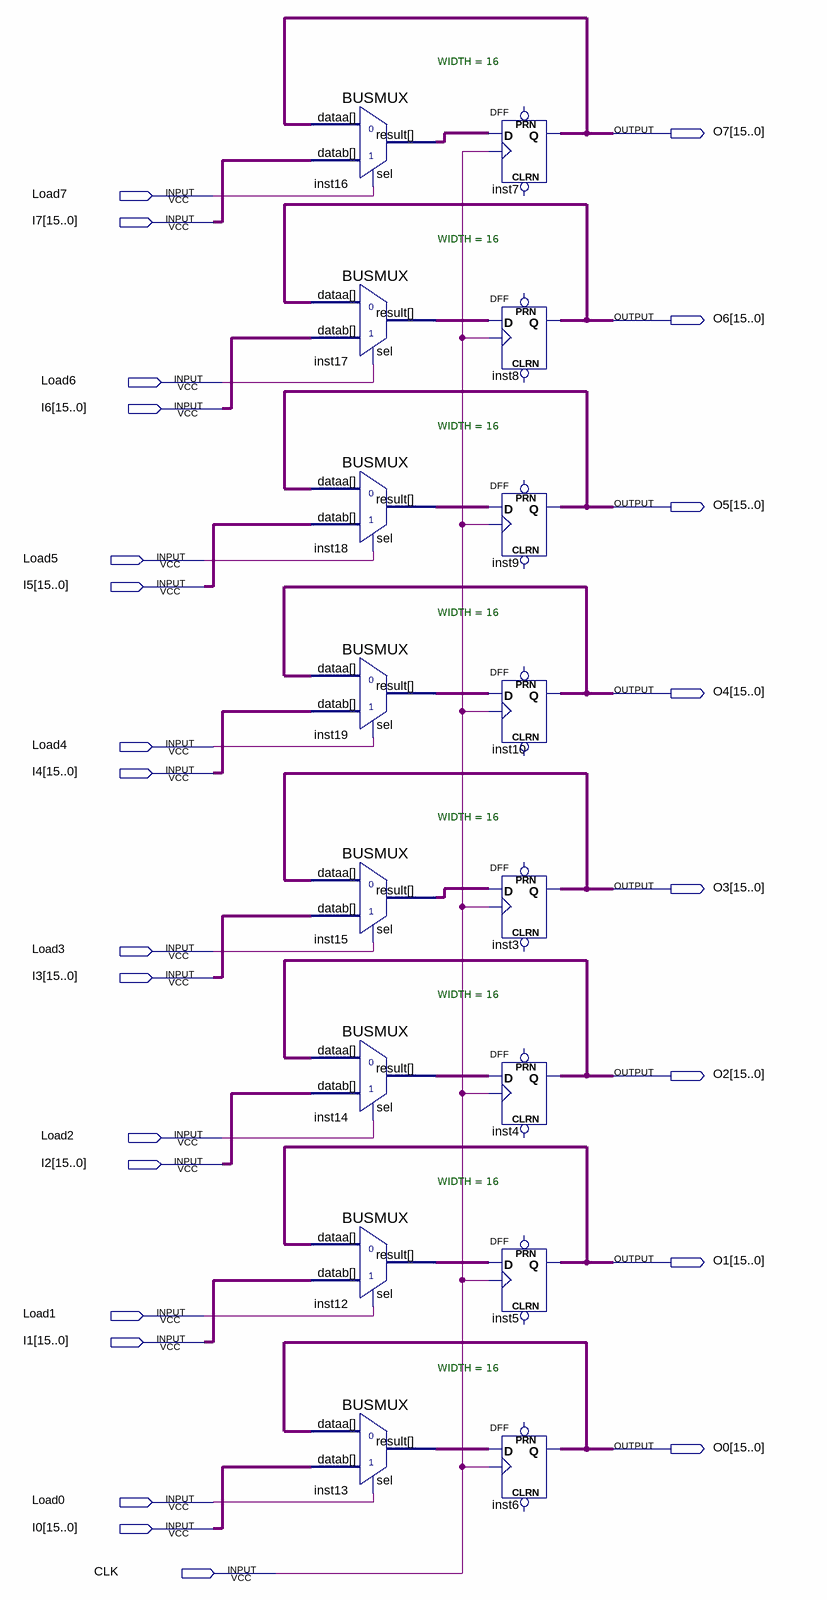
[diagram p0: schematic sheet]
// Quartus schematic REGISTER.bdf as structural Verilog: 16 symbols, 25 pins
module REGISTER (
  input  Load7,
  input  [15:0] I7,
  input  Load6,
  input  [15:0] I6,
  input  Load5,
  input  [15:0] I5,
  input  Load4,
  input  [15:0] I4,
  input  Load3,
  input  [15:0] I3,
  input  Load2,
  input  [15:0] I2,
  input  Load1,
  input  [15:0] I1,
  input  Load0,
  input  [15:0] I0,
  input  CLK,
  output [15:0] O7,
  output [15:0] O6,
  output [15:0] O5,
  output [15:0] O4,
  output [15:0] O3,
  output [15:0] O2,
  output [15:0] O1,
  output [15:0] O0
);

  wire [15:0] inst12_result, inst13_result, inst14_result, inst15_result, inst16_result, inst17_result,
       inst18_result, inst19_result;

  BUSMUX #(.WIDTH(16)) inst16 (.dataa(O7), .datab(I7), .sel(Load7), .result(inst16_result));
  BUSMUX #(.WIDTH(16)) inst17 (.dataa(O6), .datab(I6), .sel(Load6), .result(inst17_result));
  BUSMUX #(.WIDTH(16)) inst18 (.dataa(O5), .datab(I5), .sel(Load5), .result(inst18_result));
  BUSMUX #(.WIDTH(16)) inst19 (.dataa(O4), .datab(I4), .sel(Load4), .result(inst19_result));
  BUSMUX #(.WIDTH(16)) inst15 (.dataa(O3), .datab(I3), .sel(Load3), .result(inst15_result));
  BUSMUX #(.WIDTH(16)) inst14 (.dataa(O2), .datab(I2), .sel(Load2), .result(inst14_result));
  BUSMUX #(.WIDTH(16)) inst12 (.dataa(O1), .datab(I1), .sel(Load1), .result(inst12_result));
  BUSMUX #(.WIDTH(16)) inst13 (.dataa(O0), .datab(I0), .sel(Load0), .result(inst13_result));
  DFF inst7[15:0] (.CLK(CLK), .D(inst16_result), .Q(O7));  // open: CLRN, PRN
  DFF inst8[15:0] (.CLK(CLK), .D(inst17_result), .Q(O6));  // open: CLRN, PRN
  DFF inst9[15:0] (.CLK(CLK), .D(inst18_result), .Q(O5));  // open: CLRN, PRN
  DFF inst10[15:0] (.CLK(CLK), .D(inst19_result), .Q(O4));  // open: CLRN, PRN
  DFF inst3[15:0] (.CLK(CLK), .D(inst15_result), .Q(O3));  // open: CLRN, PRN
  DFF inst4[15:0] (.CLK(CLK), .D(inst14_result), .Q(O2));  // open: CLRN, PRN
  DFF inst5[15:0] (.CLK(CLK), .D(inst12_result), .Q(O1));  // open: CLRN, PRN
  DFF inst6[15:0] (.CLK(CLK), .D(inst13_result), .Q(O0));  // open: CLRN, PRN
endmodule
